# Altium schematic sheet RPL_MCU_ST.SchDoc
size A; DrawnBy: Seyed Omid Hasanli
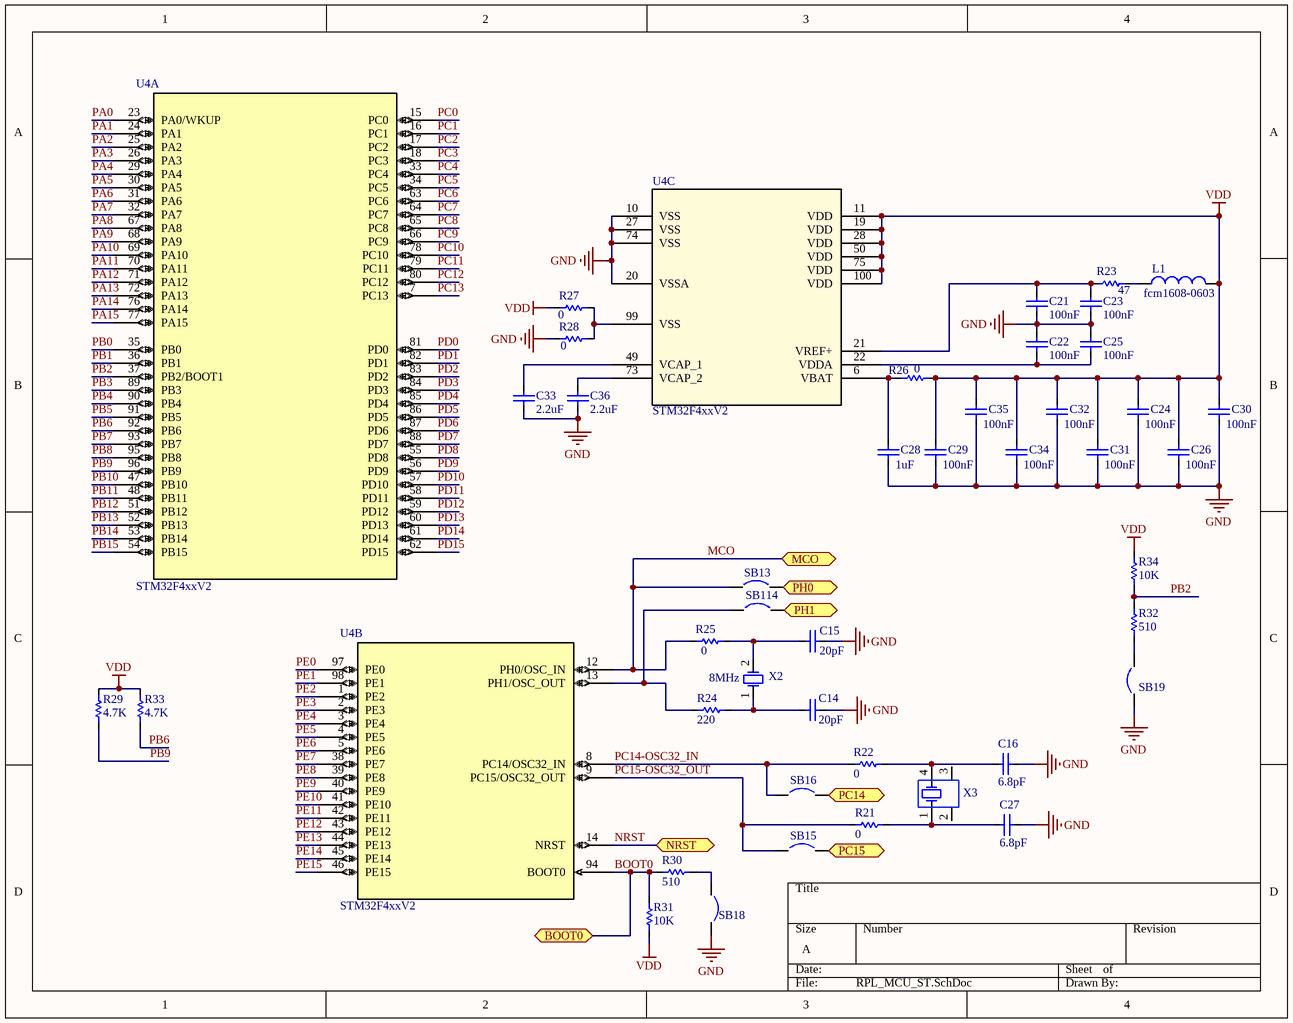
[diagram p0: RPL_MCU_ST.SchDoc]

## Parts
C14  value 20pF  [CAPC1005X55N]  (hidden comment: Cap)
C15  value 20pF  [CAPC1005X55N]  (hidden comment: Cap)
C16  value 6.8pF  [CAPC1005X55N]  (hidden comment: Cap)
C21  value 100nF  [CAPC1005X55N]  (hidden comment: Cap)
C22  value 100nF  [CAPC1005X55N]  (hidden comment: Cap)
C23  value 100nF  [CAPC1005X55N]  (hidden comment: Cap)
C24  value 100nF  [CAPC1005X55N]  (hidden comment: Cap)
C25  value 100nF  [CAPC1005X55N]  (hidden comment: Cap)
C26  value 100nF  [CAPC1005X55N]  (hidden comment: Cap)
C27  value 6.8pF  [CAPC1005X55N]  (hidden comment: Cap)
C28  value 1uF  [CAPC1005X55N]  (hidden comment: Cap)
C29  value 100nF  [CAPC1005X55N]  (hidden comment: Cap)
C30  value 100nF  [CAPC1005X55N]  (hidden comment: Cap)
C31  value 100nF  [CAPC1005X55N]  (hidden comment: Cap)
C32  value 100nF  [CAPC1005X55N]  (hidden comment: Cap)
C33  value 2.2uF  [CAPC1005X55N]  (hidden comment: Cap)
C34  value 100nF  [CAPC1005X55N]  (hidden comment: Cap)
C35  value 100nF  [CAPC1005X55N]  (hidden comment: Cap)
C36  value 2.2uF  [CAPC1005X55N]  (hidden comment: Cap)
L1  fcm1608-0603
R21  value 0  [0603]  (hidden comment: Res)
R22  value 0  [0603]  (hidden comment: Res)
R23  value 47  (hidden comment: Res)
R24  value 220  [0603]  (hidden comment: Res)
R25  value 0  [0603]  (hidden comment: Res)
R26  value 0  [0603]  (hidden comment: Res)
R27  value 0  [0603]  (hidden comment: Res)
R28  value 0  [0603]  (hidden comment: Res)
R29  value 4.7K  [0603]  (hidden comment: Res)
R30  value 510  [0603]  (hidden comment: Res)
R31  value 10K  [0603]  (hidden comment: Res)
R32  value 510  [0603]  (hidden comment: Res)
R33  value 4.7K  [0603]  (hidden comment: Res)
R34  value 10K  [0603]  (hidden comment: Res)
SB13  Circuit Breaker  (value not drawn)
SB15  Circuit Breaker  (value not drawn)
SB16  Circuit Breaker  (value not drawn)
SB18  Circuit Breaker  (value not drawn)
SB19  Circuit Breaker  (value not drawn)
SB114  Circuit Breaker  (value not drawn)
U4  STM32F4xxV2  [LQFP100-14x14mm]  (parts A,B,C of 3)
X2  value 8MHz  (hidden comment: XTAL)
X3  XTAL_4pin  (value not drawn)

## Ports
BOOT0, MCO, NRST, PC14, PC15, PH0, PH1

## Nets
GND: C14.2 C15.2 C16.2 C21.1 C22.2 C23.1 C24.1 C25.2 C26.1 C27.2 C28.1 C29.1 C30.1 C31.1 C32.1 C33.1 C34.1 C35.1 C36.1 R28.1 SB18.2 SB19.1 U4.10(VSS) U4.20(VSSA) U4.27(VSS) U4.74(VSS)
VDD: C24.2 C26.2 C29.2 C30.2 C31.2 C32.2 C34.2 C35.2 L1.2 R26.2 R27.1 R29.2 R31.2 R33.2 R34.2 U4.11(VDD) U4.19(VDD) U4.28(VDD) U4.50(VDD) U4.75(VDD) U4.100(VDD)
BOOT0: R30.1 R31.1 U4.94(BOOT0) ; port BOOT0
MCO: R25.1 SB13.1 U4.12(PH0/OSC_IN) ; port MCO
NRST: U4.14(NRST) ; port NRST
PA0: U4.23(PA0/WKUP)
PA1: U4.24(PA1)
PA2: U4.25(PA2)
PA3: U4.26(PA3)
PA4: U4.29(PA4)
PA5: U4.30(PA5)
PA6: U4.31(PA6)
PA7: U4.32(PA7)
PA8: U4.67(PA8)
PA9: U4.68(PA9)
PA10: U4.69(PA10)
PA11: U4.70(PA11)
PA12: U4.71(PA12)
PA13: U4.72(PA13)
PA14: U4.76(PA14)
PA15: U4.77(PA15)
PB0: U4.35(PB0)
PB1: U4.36(PB1)
PB2: R32.2 R34.1 U4.37(PB2/BOOT1)
PB3: U4.89(PB3)
PB4: U4.90(PB4)
PB5: U4.91(PB5)
PB6: R33.1 U4.92(PB6)
PB7: U4.93(PB7)
PB8: U4.95(PB8)
PB9: R29.1 U4.96(PB9)
PB10: U4.47(PB10)
PB11: U4.48(PB11)
PB12: U4.51(PB12)
PB13: U4.52(PB13)
PB14: U4.53(PB14)
PB15: U4.54(PB15)
PC0: U4.15(PC0)
PC1: U4.16(PC1)
PC2: U4.17(PC2)
PC3: U4.18(PC3)
PC4: U4.33(PC4)
PC5: U4.34(PC5)
PC6: U4.63(PC6)
PC7: U4.64(PC7)
PC8: U4.65(PC8)
PC9: U4.66(PC9)
PC10: U4.78(PC10)
PC11: U4.79(PC11)
PC12: U4.80(PC12)
PC13: U4.7(PC13)
PC14: SB16.2 ; port PC14
PC14-OSC32_IN: R22.1 SB16.1 U4.8(PC14/OSC32_IN)
PC15: SB15.2 ; port PC15
PC15-OSC32_OUT: R21.1 SB15.1 U4.9(PC15/OSC32_OUT)
PD0: U4.81(PD0)
PD1: U4.82(PD1)
PD2: U4.83(PD2)
PD3: U4.84(PD3)
PD4: U4.85(PD4)
PD5: U4.86(PD5)
PD6: U4.87(PD6)
PD7: U4.88(PD7)
PD8: U4.55(PD8)
PD9: U4.56(PD9)
PD10: U4.57(PD10)
PD11: U4.58(PD11)
PD12: U4.59(PD12)
PD13: U4.60(PD13)
PD14: U4.61(PD14)
PD15: U4.62(PD15)
PE0: U4.97(PE0)
PE1: U4.98(PE1)
PE2: U4.1(PE2)
PE3: U4.2(PE3)
PE4: U4.3(PE4)
PE5: U4.4(PE5)
PE6: U4.5(PE6)
PE7: U4.38(PE7)
PE8: U4.39(PE8)
PE9: U4.40(PE9)
PE10: U4.41(PE10)
PE11: U4.42(PE11)
PE12: U4.43(PE12)
PE13: U4.44(PE13)
PE14: U4.45(PE14)
PE15: U4.46(PE15)
PH0: SB13.2 ; port PH0
PH1: SB114.2 ; port PH1
NetC14_1: C14.1 R24.2 X2.1(OSC1)
NetC15_1: C15.1 R25.2 X2.2(OSC2)
NetC16_1: C16.1 R22.2 X3.4(OSC2)
NetC21_2: C21.2 C23.2 R23.1 U4.21(VREF+)
NetC22_1: C22.1 C25.1 U4.22(VDDA)
NetC27_1: C27.1 R21.2 X3.1(OSC1)
NetC28_2: C28.2 R26.1 U4.6(VBAT)
NetC33_2: C33.2 U4.49(VCAP_1)
NetC36_2: C36.2 U4.73(VCAP_2)
NetL1_1: L1.1 R23.2
NetR24_1: R24.1 SB114.1 U4.13(PH1/OSC_OUT)
NetR27_2: R27.2 R28.2 U4.99(VSS)
NetR30_2: R30.2 SB18.1
NetR32_1: R32.1 SB19.2

Not connected (* = marked no-connect by the designer): X3 2(OSC2) 3(OSC3)

## Library data of the parts
L1 = Inductor: Value: 10mH
U4 = STM32F4xxV2: Imported; Vendor: STMicroelectronics; C: Copyright (C) 2016 Accelerated Designs. All rights reserved; Manufacturer_Part_Number: stm32f4xxv2; Copyright: Copyright (C) 2016 Accelerated Designs. All rights reserved; RefDes: RefDes; Type: Type; Value: Value